# EasyEDA schematic FrSky DJT Decoder_2020-07-06_10-18-27.json
TITLE: FrSky DJT Decoder; REV: 1.0; Date: 2019-08-29; Sheet: 1/1; Drawn By: gke3500; Company: UAVX Team
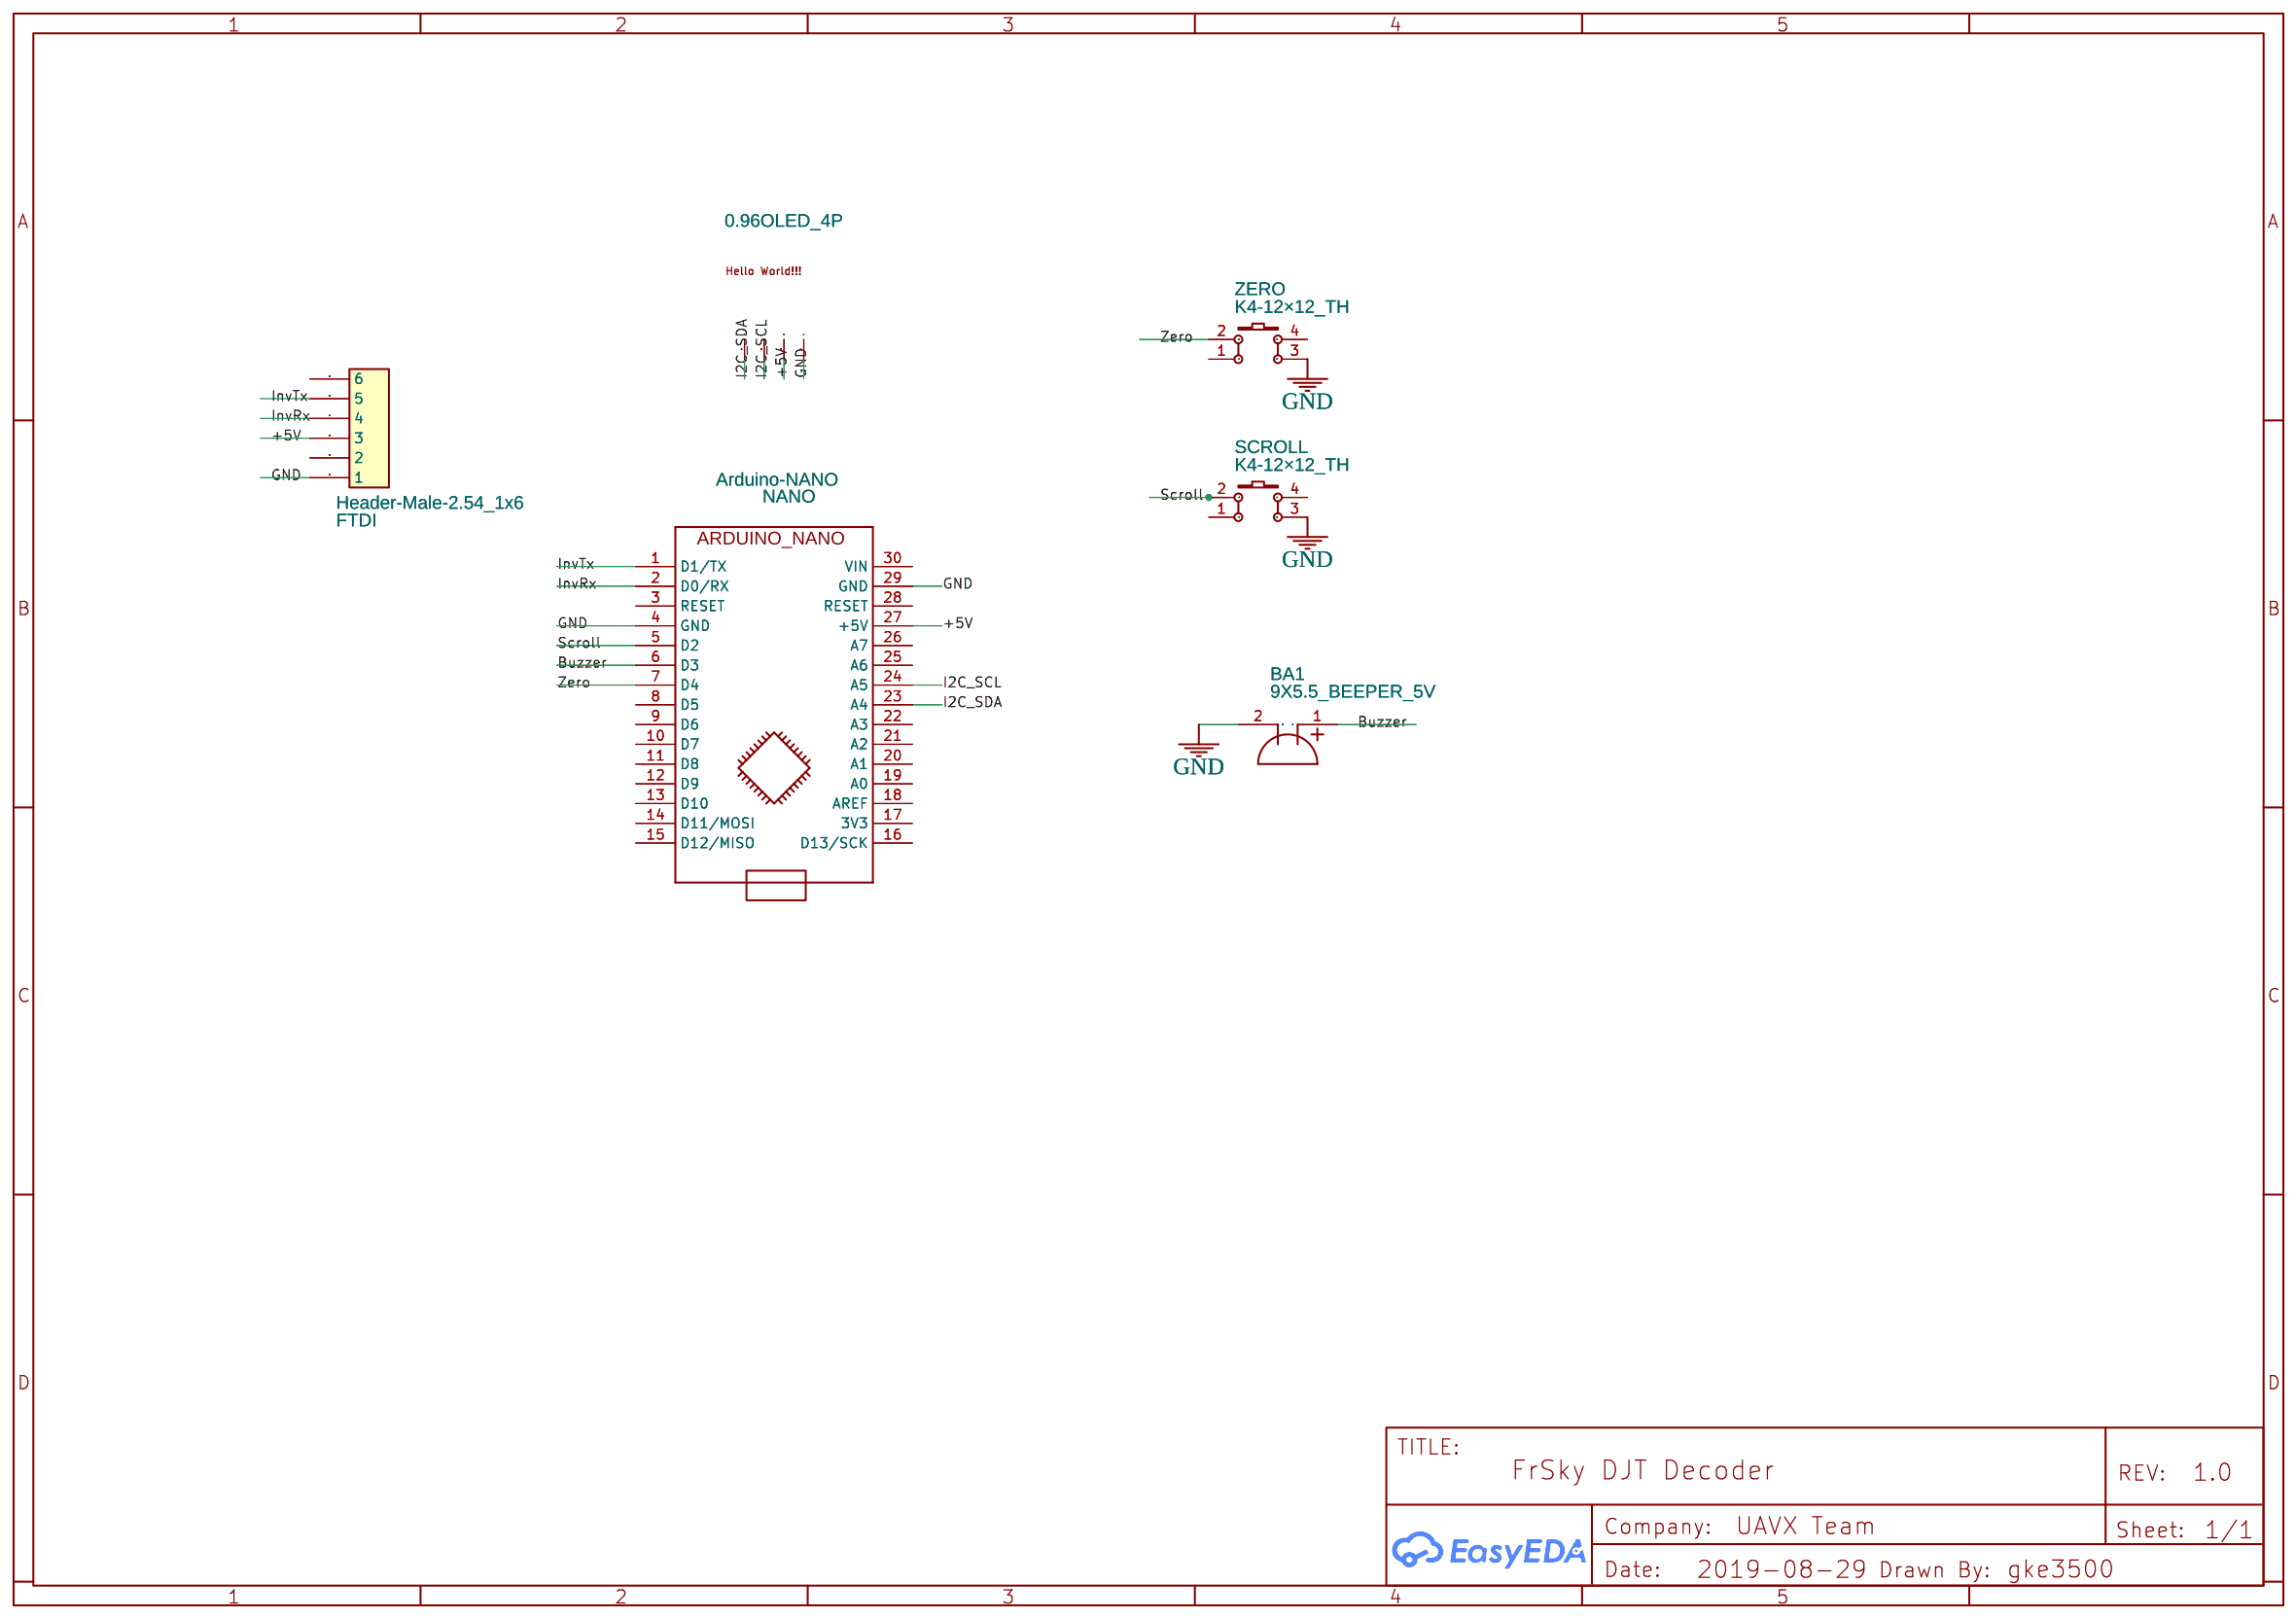
[diagram p0: schematic sheet]

## Parts
BA1  9X5.5_BEEPER_5V  [BEEPER_HC0905F_9.5X4.0MM]
FTDI  Header-Male-2.54_1x6  [HDR-6X1/2.54]
NANO  Arduino-NANO  [ARDUINO-NANO3]
OLED  0.96OLED_4P  [0.96OLED_4P]
SCROLL  K4-12×12_TH  [KEY-TH_4P-L12.0-W12.0-P5.00-LS12.5]
ZERO  K4-12×12_TH  [KEY-TH_4P-L12.0-W12.0-P5.00-LS12.5]

## Library data of the parts
BA1 = 9X5.5_BEEPER_5V: Contributor: customyota
FTDI = Header-Male-2.54_1x6: Supplier Part: C37208; Supplier: LCSC; Manufacturer: LCSC
NANO = -: Supplier Part: undefined; Contributor: Pgran
OLED = 0.96OLED_4P: Supplier: LCSC; Contributor: LCEDA_Lib
SCROLL ZERO = K4-12×12_TH: Supplier Part: C128053; Supplier: LCSC; Manufacturer: 韩国韩荣; Manufacturer Part: K2-1103DP-M4SW-04; Contributor: LCEDA_Lib

## Nets
+5V: FTDI.3 NANO.27(+5V) OLED.3
GND: BA1.2 FTDI.1 NANO.4(GND) NANO.29(GND) OLED.4 SCROLL.3 ZERO.3
Buzzer: BA1.1 NANO.6(D3)
I2C_SCL: NANO.24(A5) OLED.2
I2C_SDA: NANO.23(A4) OLED.1
InvRx: FTDI.4 NANO.2(D0/RX)
InvTx: FTDI.5 NANO.1(D1/TX)
Scroll: NANO.5(D2) SCROLL.2
Zero: NANO.7(D4) ZERO.2

Not connected (* = marked no-connect by the designer): FTDI 2 6; NANO 3(RESET) 8(D5) 9(D6) 10(D7) 11(D8) 12(D9) 13(D10) 14(D11/MOSI) 15(D12/MISO) 16(D13/SCK) 17(3V3) 18(AREF) 19(A0) 20(A1) 21(A2) 22(A3) 25(A6) 26(A7) 28(RESET) 30(VIN); SCROLL 1 4; ZERO 1 4
